# EAGLE design schematic (EAGLE 5.11)
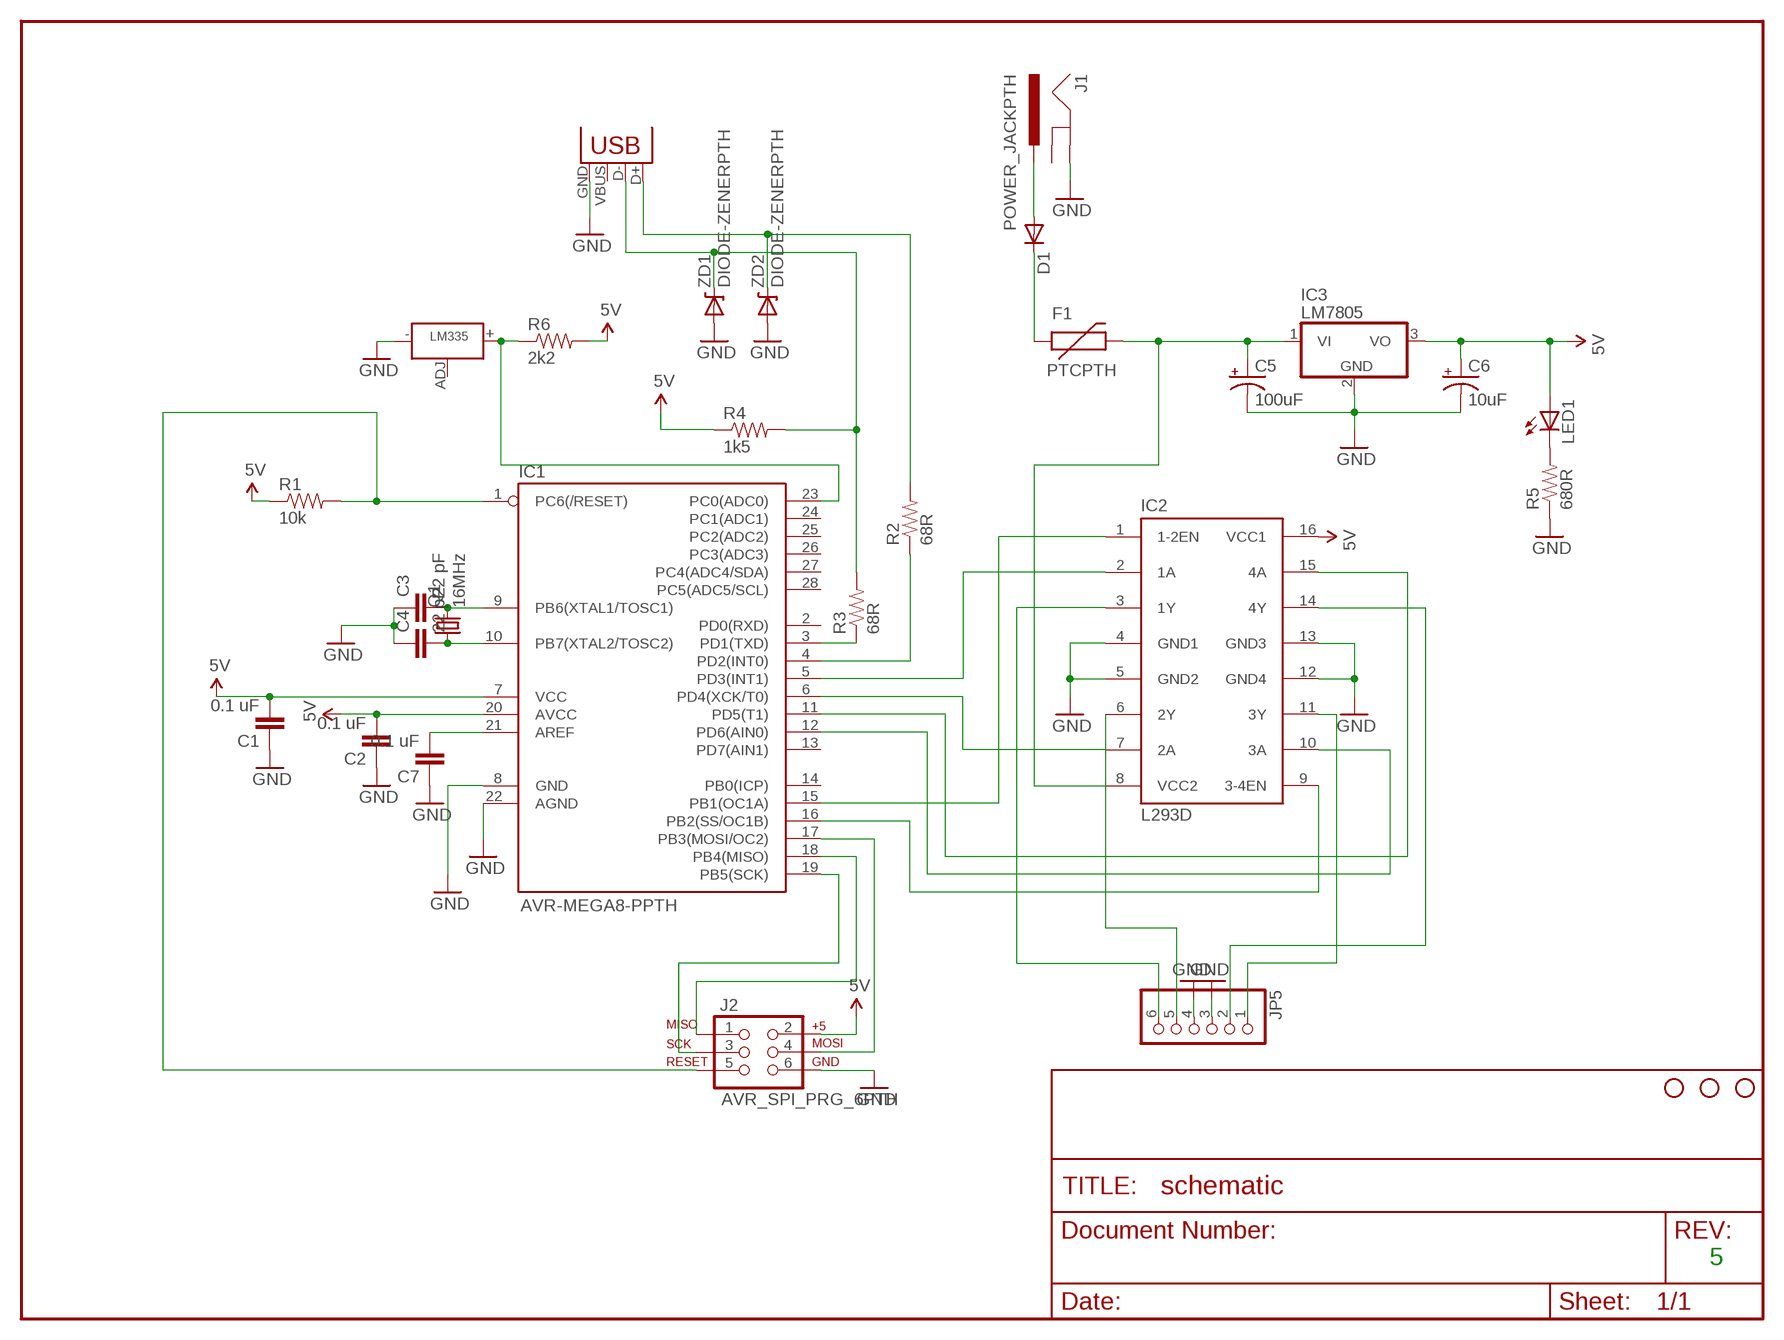
[diagram p0: schematic, sheet 1]

## Parts
C1  0.1 uF  CAPPTH  [CAP-PTH-SMALL]
C2  0.1 uF  CAPPTH  [CAP-PTH-SMALL]
C3  22 pF  CAPPTH  [CAP-PTH-SMALL]
C4  22 pF  CAPPTH  [CAP-PTH-SMALL]
C5  100uF  CAP_POLPTH1  [CPOL-RADIAL-100UF-25V]
C6  10uF  CAP_POLPTH2  [CPOL-RADIAL-10UF-25V]
C7  0.1 uF  CAPPTH  [CAP-PTH-SMALL]
D1  DIODE1N4148  [DIODE-1N4148]
F1  PTCPTH  [PTC]
IC1  AVR-MEGA8-PPTH  [DIL28-3]
IC2  L293D  [DIL16]
IC3  LM7805  7805T  [TO220H]
J1  POWER_JACKPTH  [POWER_JACK_PTH]
J2  AVR_SPI_PRG_6PTH  [2X3]
JP2  STAND-OFF  [STAND-OFF]
JP3  STAND-OFF  [STAND-OFF]
JP4  STAND-OFF  [STAND-OFF]
JP5  PINHD-1X6  [1X06]
LED1  LED3MM  [LED3MM]
Q1  16MHz  CRYSTALHC49US  [HC49US]
R1  10k  RESISTORPTH1  [AXIAL-0.3]
R2  68R  RESISTORPTH1  [AXIAL-0.3]
R3  68R  RESISTORPTH1  [AXIAL-0.3]
R4  1k5  RESISTORPTH1  [AXIAL-0.3]
R5  680R  RESISTORPTH1  [AXIAL-0.3]
R6  2k2  RESISTORPTH1  [AXIAL-0.3]
U$8  LM335A  [TO-92-3]
X2  USBPTH  [USB-B-PTH]
ZD1  DIODE-ZENERPTH  [DIODE-ZENER]
ZD2  DIODE-ZENERPTH  [DIODE-ZENER]

## Nets
5V: C1.2 C2.2 C6.1(+) IC1.7(VCC) IC1.20(AVCC) IC2.16(VCC1) IC3.3(VO) J2.2 LED1.A R1.P$1 R4.P$1 R6.P$2
12V: C5.1(+) F1.P$2 IC2.8(VCC2) IC3.1(VI)
GND: C1.1 C2.1 C3.1 C4.1 C5.2(-) C6.2(-) C7.1 IC1.8(GND) IC1.22(AGND) IC2.4(GND1) IC2.5(GND2) IC2.12(GND4) IC2.13(GND3) IC3.2(GND) J1.GND J2.6 JP5.3 JP5.4 R5.P$1 U$8.- X2.GND ZD1.P$2(A) ZD2.P$2(A)
N$1: C7.2 IC1.21(AREF)
N$2: IC1.23(PC0(ADC0)) R6.P$1 U$8.+
N$3: IC2.3(1Y) JP5.6
N$4: C3.2 IC1.9(PB6(XTAL1/TOSC1)) Q1.2
N$5: C4.2 IC1.10(PB7(XTAL2/TOSC2)) Q1.1
N$6: IC2.6(2Y) JP5.5
N$8: IC2.14(4Y) JP5.2
N$9: IC2.11(3Y) JP5.1
N$11: IC1.19(PB5(SCK)) J2.3
N$12: D1.C F1.P$1
N$13: IC1.17(PB3(MOSI/OC2)) J2.4
N$14: R3.P$2 R4.P$2 X2.D- ZD1.P$1(C)
N$15: R2.P$2 X2.D+ ZD2.P$1(C)
N$16: IC1.3(PD1(TXD)) R3.P$1
N$17: IC1.4(PD2(INT0)) R2.P$1
N$18: IC1.18(PB4(MISO)) J2.1
N$20: IC1.1(PC6(/RESET)) J2.5 R1.P$2
N$21: IC1.5(PD3(INT1)) IC2.2(1A)
N$22: IC1.6(PD4(XCK/T0)) IC2.7(2A)
N$23: IC1.11(PD5(T1)) IC2.15(4A)
N$24: IC1.12(PD6(AIN0)) IC2.10(3A)
N$25: IC1.15(PB1(OC1A)) IC2.1(1-2EN)
N$26: IC1.16(PB2(SS/OC1B)) IC2.9(3-4EN)
N$27: LED1.K(C) R5.P$2
N$28: D1.A J1.PWR
Unconnected: IC1.2(PD0(RXD)) IC1.13(PD7(AIN1)) IC1.14(PB0(ICP)) IC1.24(PC1(ADC1)) IC1.25(PC2(ADC2)) IC1.26(PC3(ADC3)) IC1.27(PC4(ADC4/SDA)) IC1.28(PC5(ADC5/SCL)) J1.GNDBREAK U$8.ADJ X2.VBUS

## Notes on the sheet
- 5

## Library data of the parts
C1-C4 C7 = SparkFun:CAP: Capacitor Standard 0603 ceramic capacitor, and 0.1" leaded capacitor.
C5 C6 = SparkFun:CAP_POL: Capacitor Polarized These are standard SMD and PTH capacitors. Normally 10uF, 47uF, and 100uF in electrolytic and tantalum varieties. Always verify the external diameter of the through hole cap, it varies with capacity, voltage, and manufacturer. The EIA devices should be standard.
D1 = SparkFun:DIODE: Diode These are standard reverse protection diodes and small signal diodes. SMA package can handle up to about 1A. SOD-323 can handle about 200mA. What the SOD-323 package when ordering, there are some mfgs out there that are 5-pin packages.
F1 = SparkFun:PTC: Resettable Fuse PTC Resettable Fuse. Spark Fun Electronics SKU : COM-08357
IC1 = SparkFun:AVR-MEGA8-P: MICROCONTROLLER 8 Kbytes FLASH 1 kbytes SRAM 512 bytes EEPROM USART 4-channel 10 bit ADC 2-channel 8 bit ADC
IC2 = st-microelectronics:L293D: PUSH-PULL 4 CHANNEL DRIVER
IC3 = linear:78*: Positive VOLTAGE REGULATOR Source: http://cache.national.com/ds/LM/LM78L05.pdf http://www.fairchildsemi.com/ds/LM/LM7805.pdf
J1 = SparkFun:POWER_JACK: Power Jack This is the standard 5.5mm barrel jack for power. The PTH is the most common, proven, reliable, footprint. All others are experimental. The Slot footprint only works if the mill layer is transmitted to the PCB fab house so be warned. Spark Fun Electronics SKU : PRT-00119. Mating wall wart : TOL-00298 (and others)
J2 = SparkFun:AVR_SPI_PRG_6: AVR ISP 6 Pin This is the reduced ISP connector for AVR programming. Common on Arduino. This footprint will take up less PCB space and can be used with a 10-pin to 6-pin adapter such as SKU: BOB-08508
JP2-JP4 = SparkFun:STAND-OFF: Stand Off This is the mechanical footprint for a #4 phillips button head screw. Use the keepout ring to avoid running the screw head into surrounding components. SKU : PRT-00447
JP5 = pinhead:PINHD-1X6: PIN HEADER
LED1 = SparkFun:LED: LEDs Standard schematic elements and footprints for 5mm, 3mm, 1206, and 0603 sized LEDs. 5mm - Spark Fun Electronics SKU : COM-00529 (and others)
Q1 = SparkFun:CRYSTAL: Crystals Various standard crystals. Proven footprints. Spark Fun Electronics SKU : COM-00534
R1-R6 = SparkFun:RESISTOR: Resistor Basic schematic elements and footprints for 0603, 1206, and PTH 1/10th watt (small) resistors.
U$8 = EJH:LM335A
X2 = SparkFun:USB: USB Connectors USB-B-PTH is fully proven SKU : PRT-00139 USB-miniB is fully proven SKU : PRT-00587 USB-A-PCB is untested. USB-A-H is throughly reviewed, but untested. Spark Fun Electronics SKU : PRT-00437 USB-B-SMT is throughly reviewed, but untested. Needs silkscreen touching up. USB-A-S has not been used/tested USB-MB-H has not been used/tested
ZD1 ZD2 = SparkFun:DIODE-ZENER: Zener Diode Production Part - 8199 3.4V Zener Voltage

## Board
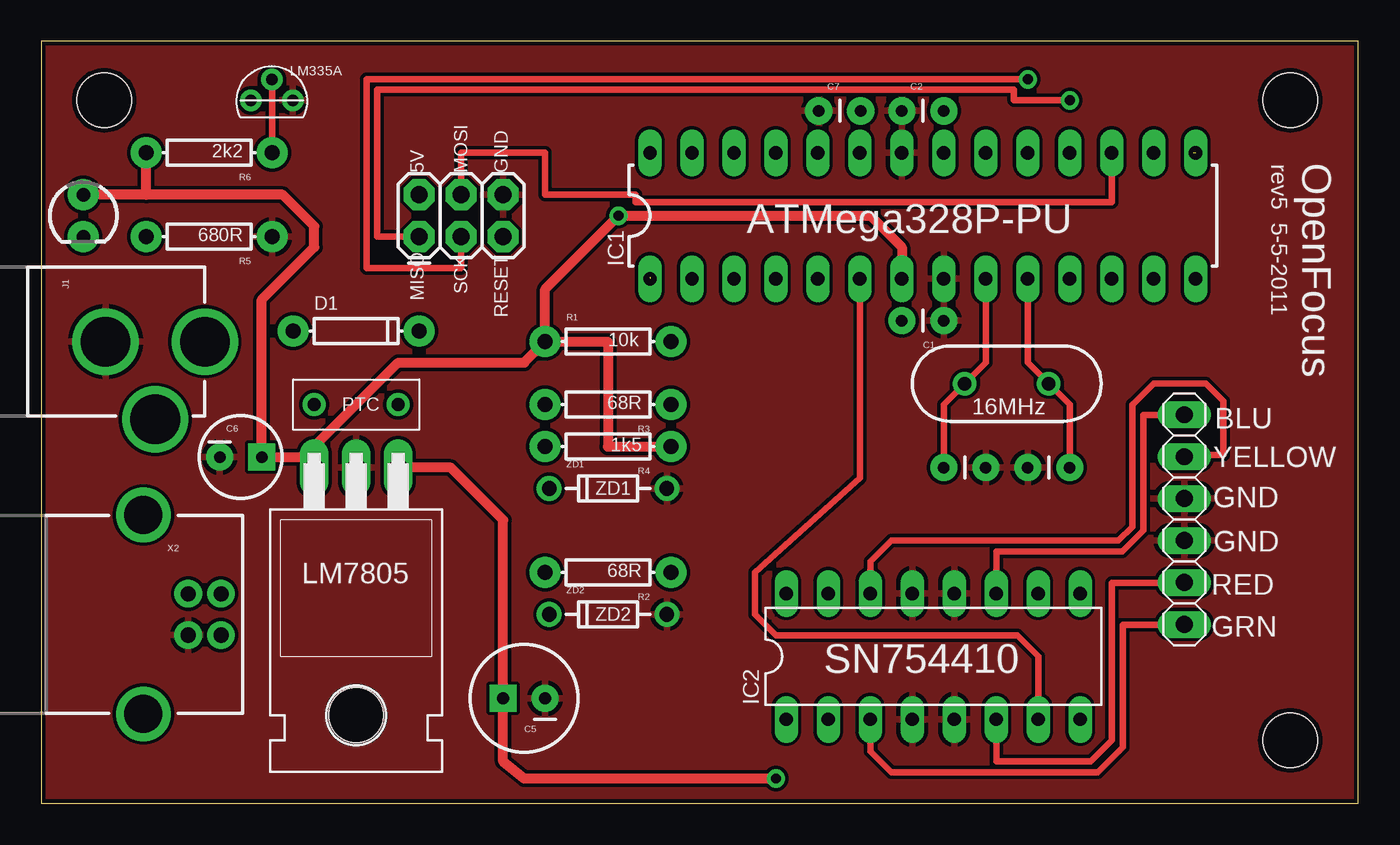
[diagram p1: board, top side]
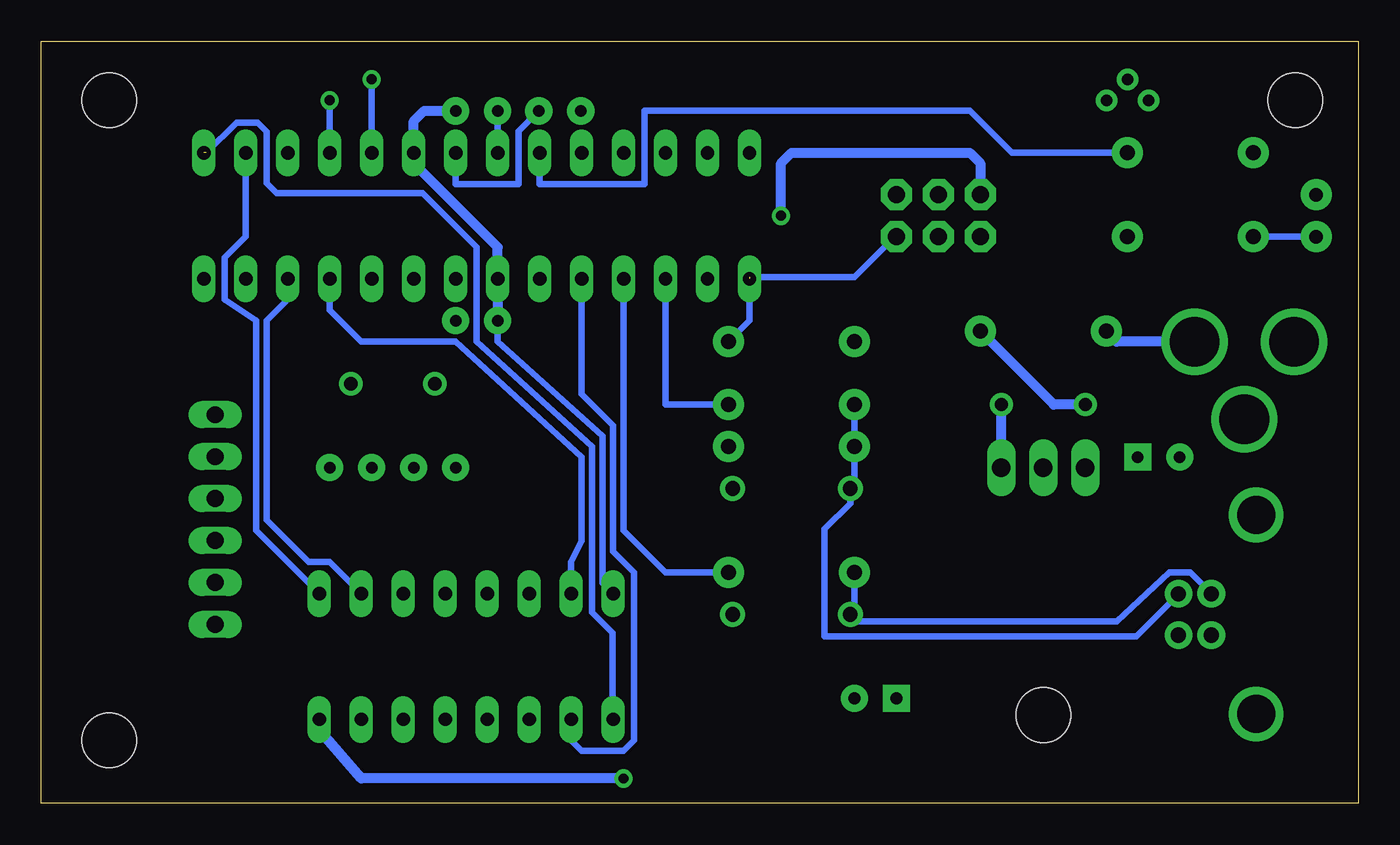
[diagram p2: board, bottom side, seen from below]

Size 79.68 x 46.12 mm. Coordinates in mm from the lower left corner, seen from the top.
Outline: 0,0 79.68,0 79.68,46.12 0,46.12 0,0
Copper layers (1*16): Top 0.035mm / dielectric 1.5mm / Bottom 0.035mm
Design rules "sparkfun": minimum track width 8mil, minimum drill 20mil, track to track 8mil, track to pad 8mil, pad to pad 8mil, via to via 8mil, smd to smd 8mil, copper to edge 10mil, drill to drill 8mil, minimum pad ring 12mil, minimum via ring 10mil, stop-mask expansion 4mil, vias tented up to drill 25mil, thermal gap 10mil

### Footprints (pad centres in the part's own frame; a part is rotated, then mirrored left to right if it is on the bottom)
CAP-PTH-SMALL = drill 0.7 pad 1.651 round: 1 0,0; 2 2.54,0
CPOL-RADIAL-100UF-25V = drill 0.7 pad 1.651 square: 1 1.27,0 | drill 0.7 pad 1.651 round: 2 -1.27,0
CPOL-RADIAL-10UF-25V = drill 0.7 pad 1.651 square: 1 1.27,0 | drill 0.7 pad 1.651 round: 2 -1.27,0
DIODE-1N4148 = drill 0.9 pad 1.88 round: A -3.81,0; C 3.81,0
PTC = drill 0.8 round: P$1 -2.54,0; P$2 2.54,0
DIL28-3 = drill 0.813 long: 1 -16.51,-3.81; 2 -13.97,-3.81; 3 -11.43,-3.81; 4 -8.89,-3.81; 5 -6.35,-3.81; 6 -3.81,-3.81; 7 -1.27,-3.81; 8 1.27,-3.81; 9 3.81,-3.81; 10 6.35,-3.81; 11 8.89,-3.81; 12 11.43,-3.81; 13 13.97,-3.81; 14 16.51,-3.81; 15 16.51,3.81; 16 13.97,3.81; 17 11.43,3.81; 18 8.89,3.81; 19 6.35,3.81; 20 3.81,3.81; 21 1.27,3.81; 22 -1.27,3.81; 23 -3.81,3.81; 24 -6.35,3.81; 25 -8.89,3.81; 26 -11.43,3.81; 27 -13.97,3.81; 28 -16.51,3.81
DIL16 = drill 0.813 long: 1 -8.89,-3.81; 2 -6.35,-3.81; 3 -3.81,-3.81; 4 -1.27,-3.81; 5 1.27,-3.81; 6 3.81,-3.81; 7 6.35,-3.81; 8 8.89,-3.81; 9 8.89,3.81; 10 6.35,3.81; 11 3.81,3.81; 12 1.27,3.81; 13 -1.27,3.81; 14 -3.81,3.81; 15 -6.35,3.81; 16 -8.89,3.81
TO220H = drill 1.118 long: 1 -2.54,-10.16; 2 0,-10.16; 3 2.54,-10.16 | hole 3.302: 0,4.826
POWER_JACK_PTH = drill 2.997 round: GND 0,7.7; GNDBREAK 4.7,10.7; PWR 0,13.7
2X3 = drill 1.016 pad 1.88 octagon: 1 0,0; 2 0,2.54; 3 2.54,0; 4 2.54,2.54; 5 5.08,0; 6 5.08,2.54
STAND-OFF = hole 3.302: 0,0
1X06 = drill 1.016 long: 1 -6.35,0; 2 -3.81,0; 3 -1.27,0; 4 1.27,0; 5 3.81,0; 6 6.35,0
LED3MM = drill 0.813 pad 1.88 round: A -1.27,0; K 1.27,0
HC49US = drill 0.813 round: 1 -2.54,0; 2 2.54,0
AXIAL-0.3 = drill 0.9 pad 1.88 round: P$1 -3.81,0; P$2 3.81,0
TO-92-3 = drill 0.7 pad 1.27 round: + 0,1.27; - 1.27,0; ADJ -1.27,0
USB-B-PTH = drill 0.914 pad 1.676 round: D+ 0,1.25; D- 1.981,1.25; GND 0,-1.25; VBUS 1.981,-1.25 | drill 2.286 round: P$1 -2.718,-6.02; P$2 -2.718,6.02
DIODE-ZENER = drill 0.9 round: P$1 -3.556,0; P$2 3.556,0

### Placement (x,y rotation side)
C1  54.61,29.21 180 top
C2  52.07,41.91 0 top
C3  57.15,20.32 180 top
C4  59.69,20.32 0 top
C5  29.21,6.35 180 top
C6  12.06,20.96 0 top
C7  47.04,41.91 0 top
D1  19.05,28.57 0 top
F1  19.05,24.13 0 top
IC1  53.34,35.56 0 top
IC2  53.98,8.89 0 top
IC3  19.05,10.16 180 top
J1  -3.81,27.94 270 top
J2  22.86,34.29 0 top
JP2  75.56,42.54 0 top
JP3  75.56,3.81 0 top
JP4  3.81,42.54 0 top
JP5  69.16,17.17 270 top
LED1  2.54,35.56 270 top
Q1  58.42,25.4 180 top
R1  34.29,27.94 0 top
R2  34.29,13.97 180 top
R3  34.29,24.13 180 top
R4  34.29,21.59 180 top
R5  10.16,34.29 180 top
R6  10.16,39.37 180 top
U$8  13.94,42.54 0 top
X2  8.89,11.43 0 top
ZD1  34.29,19.05 0 top
ZD2  34.29,11.43 0 top

### Tracks (layer width: path | path; a pad name or v marks a point on that pad's centre or on a via)
5V  (via drill 0.6)
  Top 0.61: R1.P$1 29.21,26.67 21.59,26.67 16.51,21.59 16.51,20.96 C6.1 13.34,30.48 16.51,33.65 16.51,34.92 14.61,36.83 6.35,36.83 | 6.35,36.83 LED1.A | R1.P$1 30.48,31.11 v34.92,35.56 50.16,35.56 52.07,33.65 IC1.7 | 6.35,36.83 R6.P$2 | R1.P$1 34.29,27.94 34.29,21.59 R4.P$1
  Top 1.016: 16.51,20.96 IC3.3
  Bottom 0.406: IC2.16 45.72,13.34 45.72,22.23 52.07,27.94 C1.2
  Bottom 0.61: C1.2 IC1.7 52.07,33.65 57.15,38.73 IC1.20 57.15,41.27 56.52,41.91 C2.2 | J2.2 22.86,38.73 23.5,39.37 34.29,39.37 34.92,38.73 v34.92,35.56
12V  (via drill 0.6)
  Top 0.61: v44.45,1.5 29.21,1.5 27.94,2.54 C5.1 27.94,17.14 24.77,20.32 IC3.1
  Bottom 0.61: IC2.8 62.87,4.45 60.33,1.5 v44.45,1.5 | IC3.1 F1.P$2
GND
  Bottom 0.406: IC1.22 C2.1
  pour Top: 0,46.35 80.01,46.35 80.01,0 0,0
N$1
  Bottom 0.406: IC1.21 54.61,37.46 50.8,37.46 50.8,40.69 C7.2
N$2
  Top 0.406: U$8.+ 13.97,43.81 R6.P$1
  Bottom 0.406: R6.P$1 20.95,39.37 23.5,41.91 43.18,41.91 43.18,37.46 49.53,37.46 IC1.23
N$3
  Top 0.406: IC2.3 50.16,3.15 51.44,1.88 63.93,1.88 65.43,3.38 65.43,10.79 69.14,10.79 JP5.6
N$4
  Top 0.406: C3.2 54.61,24.13 Q1.2 57.15,26.67 IC1.9
N$5
  Top 0.406: C4.2 62.23,24.13 Q1.1 59.69,26.67 IC1.10
N$6
  Top 0.406: IC2.6 57.78,2.54 63.5,2.54 64.77,3.81 64.77,13.34 69.14,13.34 JP5.5
N$8
  Top 0.406: IC2.14 50.16,14.63 51.44,15.9 65.18,15.9 66.02,16.74 66.02,24.13 66.04,24.13 67.31,25.4 70.46,25.4 71.53,24.33 71.53,21.08 69.16,21.08 JP5.2 69.19,20.96
N$9
  Top 0.406: IC2.11 57.78,15.24 65.41,15.24 66.67,16.51 66.67,23.5 69.14,23.5 JP5.1
N$11  (via drill 0.6)
  Top 0.406: v59.69,43.81 19.68,43.81 19.68,32.38 25.4,32.38 J2.3
  Bottom 0.406: v59.69,43.81 IC1.19
N$12
  Bottom 0.61: D1.C 18.41,24.13 F1.P$1
N$13
  Top 0.406: IC1.17 64.77,36.4 35.97,36.4 35.97,36.83 30.48,36.83 30.48,39.37 25.4,39.37 J2.4
N$14
  Bottom 0.406: X2.D- 10.97,12.55 13.41,10.11 32.31,10.11 32.31,16.61 32.28,16.61 30.73,18.16 ZD1.P$1 30.48,19.3 R4.P$2 R3.P$2
N$15
  Bottom 0.406: X2.D+ 8.94,12.75 10.16,13.97 11.43,13.97 14.61,11 30.3,11 ZD2.P$1 30.48,11.68 R2.P$2
N$16
  Bottom 0.406: IC1.3 41.91,24.13 R3.P$1
N$17
  Bottom 0.406: R2.P$1 41.91,13.97 44.45,16.51 IC1.4
N$18  (via drill 0.6)
  Top 0.406: v62.23,42.54 58.85,42.54 58.85,43.18 20.32,43.18 20.32,34.29 J2.1
  Bottom 0.406: v62.23,42.54 IC1.18
N$20  (1 unrouted)
  Bottom 0.406: J2.5 28.04,34.29 30.48,31.85 36.83,31.85 | R1.P$2 36.83,29.21 IC1.1
N$21
  Bottom 0.406: IC1.5 46.99,24.77 45.09,22.86 45.09,15.24 43.81,13.97 43.81,3.81 44.45,3.18 46.99,3.18 47.62,3.81 IC2.2
N$22
  Top 0.406: IC1.6 49.53,19.68 43.18,13.97 43.18,11.43 44.45,10.16 59.05,10.16 60.33,8.89 IC2.7
N$23
  Bottom 0.406: IC2.15 47.62,14.61 46.99,15.88 46.99,20.96 54.61,27.94 60.33,27.94 62.23,29.84 IC1.11
N$24
  Bottom 0.406: IC2.10 62.23,14.61 63.5,14.61 66.04,17.14 66.04,29.21 64.77,30.48 IC1.12
N$25  (1 unrouted)
  Bottom 0.406: 69.7,39.37 67.87,41.2 66.6,41.2 66.04,40.64 66.04,37.54 65.43,36.93 56.62,36.93 53.34,33.65 53.34,27.94 46.35,21.59 46.35,11.56 45.11,10.31 45.11,5.11 IC2.1
N$26
  Bottom 0.406: IC2.9 66.67,16.51 66.67,29.21 68.58,30.48 68.58,33.02 67.31,34.29 IC1.16
N$27
  Bottom 0.406: LED1.K R5.P$2
N$28
  Bottom 0.61: J1.PWR 14.61,27.94 D1.A

### Text on the board
tPlace: LM335A | rev5 5-5-2011 | OpenFocus | 5V | MOSI | GND | ATMega328P-PU | MISO | SCK | RESET | PTC | 16MHz | BLU | YELLOW | ZD1 | GND | GND | RED | ZD2 | GRN | SN754410